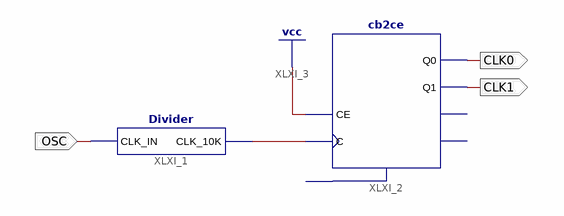
[diagram p0: schematic sheet 1]
// Xilinx ISE schematic Sel_clk.sch (spartan6) as structural Verilog: 2 symbols, 3 ports
module Sel_clk (
  input  OSC,
  output CLK1,
  output CLK0
);

  wire XLXN_1;

  Divider XLXI_1 (.CLK_IN(OSC), .CLK_10K(XLXN_1));
  cb2ce XLXI_2 (.C(XLXN_1), .CE(1'b1), .Q0(CLK0), .Q1(CLK1));  // open: CLR, CEO, TC
endmodule
